# Altium project Crane-control-system.PrjPcb
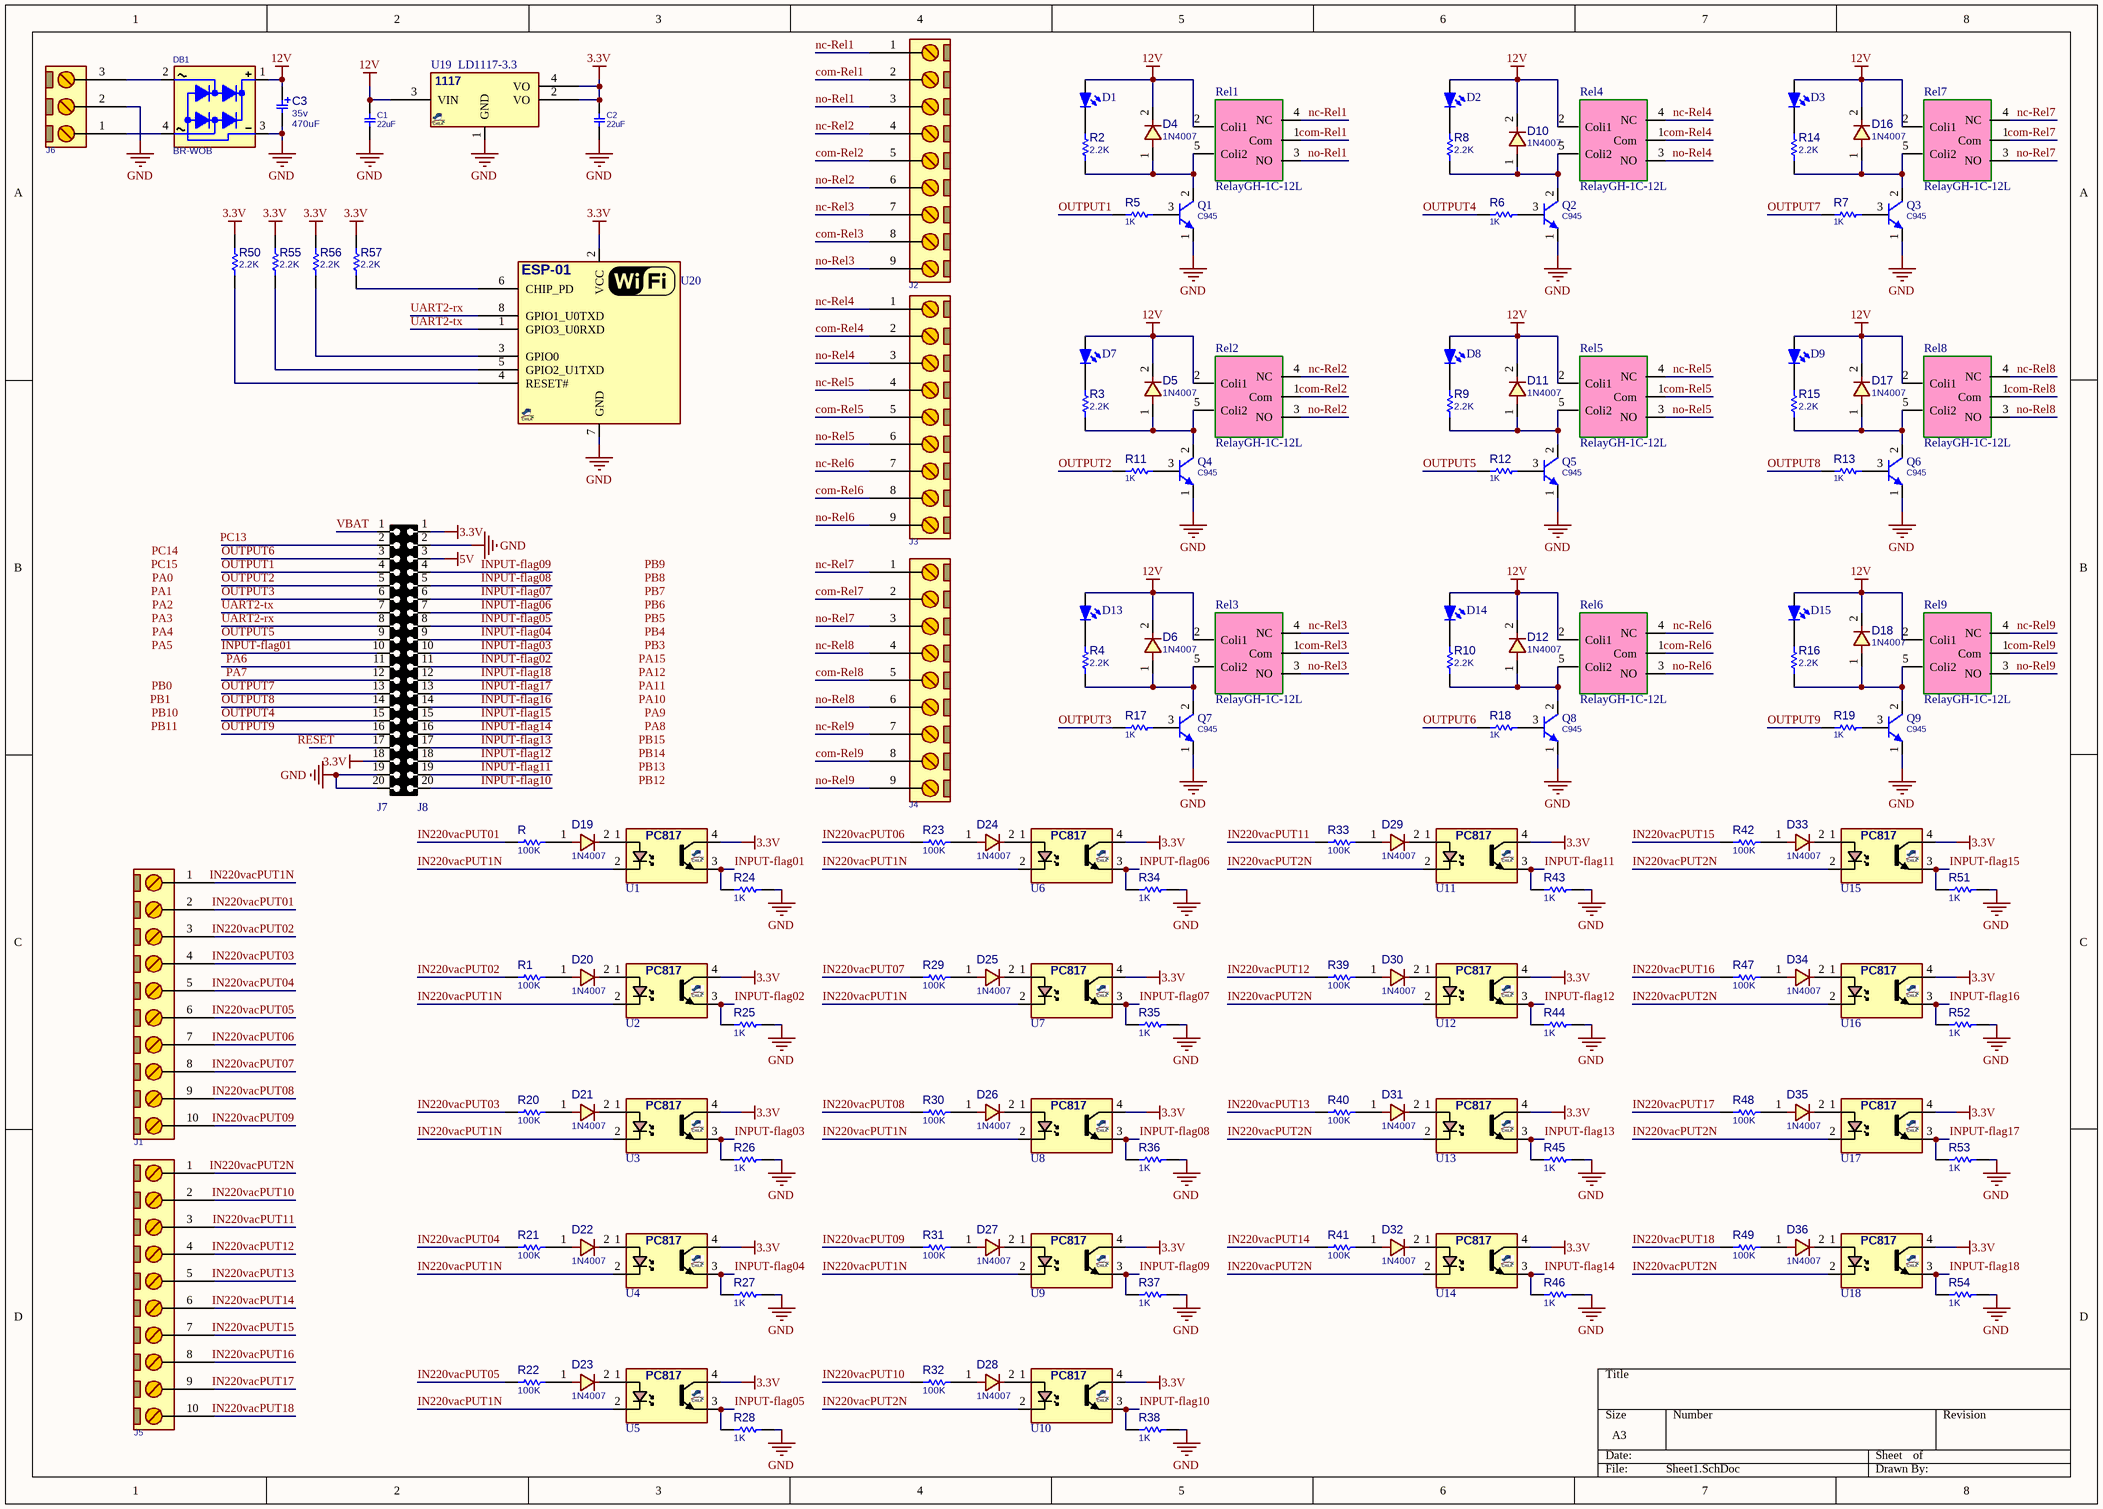
[diagram p0: Sheet1.SchDoc]
1 sheet, 144 parts. Net scope: global (net labels, ports and power ports of the same name join across sheets).
Board file: PCB1.PcbDoc

## Sheet Sheet1.SchDoc
size A3; SheetNumber: 1; SheetTotal: 1

### Parts
C1  22uF  [C0805]
C2  22uF  [C0805]
C3  PARAM2: 35v  [C_EL_10X16]  (hidden comment: 470uF)
D1  (no value)  [0805 LED]
D2  (no value)  [0805 LED]
D3  (no value)  [0805 LED]
D4  1N4007  [D_SMA]
D5  1N4007  [D_SMA]
D6  1N4007  [D_SMA]
D7  (no value)  [0805 LED]
D8  (no value)  [0805 LED]
D9  (no value)  [0805 LED]
D10  1N4007  [D_SMA]
D11  1N4007  [D_SMA]
D12  1N4007  [D_SMA]
D13  (no value)  [0805 LED]
D14  (no value)  [0805 LED]
D15  (no value)  [0805 LED]
D16  1N4007  [D_SMA]
D17  1N4007  [D_SMA]
D18  1N4007  [D_SMA]
D19  1N4007  [D_SMA]
D20  1N4007  [D_SMA]
D21  1N4007  [D_SMA]
D22  1N4007  [D_SMA]
D23  1N4007  [D_SMA]
D24  1N4007  [D_SMA]
D25  1N4007  [D_SMA]
D26  1N4007  [D_SMA]
D27  1N4007  [D_SMA]
D28  1N4007  [D_SMA]
D29  1N4007  [D_SMA]
D30  1N4007  [D_SMA]
D31  1N4007  [D_SMA]
D32  1N4007  [D_SMA]
D33  1N4007  [D_SMA]
D34  1N4007  [D_SMA]
D35  1N4007  [D_SMA]
D36  1N4007  [D_SMA]
DB1  BR-WOB  [DBRG_C10]
J1  CONN_TB10  [MSTB_10]  (value not drawn)
J2  CONN_TB9  [MSTB_9]  (value not drawn)
J3  CONN_TB9  [MSTB_9]  (value not drawn)
J4  CONN_TB9  [MSTB_9]  (value not drawn)
J5  CONN_TB10  [MSTB_10]  (value not drawn)
J6  CONN_TB3  [MSTB_3]  (value not drawn)
J7  HDRF20  [HDR_F_1X20]  (value not drawn)
J8  HDRF20  [HDR_F_1X20]  (value not drawn)
Q1  C945  [TO92_3]
Q2  C945  [TO92_3]
Q3  C945  [TO92_3]
Q4  C945  [TO92_3]
Q5  C945  [TO92_3]
Q6  C945  [TO92_3]
Q7  C945  [TO92_3]
Q8  C945  [TO92_3]
Q9  C945  [TO92_3]
R  100K  [R0805]
R1  100K  [R0805]
R2  2.2K  [R0805]
R3  2.2K  [R0805]
R4  2.2K  [R0805]
R5  1K  [R025W_AX04]
R6  1K  [R025W_AX04]
R7  1K  [R025W_AX04]
R8  2.2K  [R0805]
R9  2.2K  [R0805]
R10  2.2K  [R0805]
R11  1K  [R025W_AX04]
R12  1K  [R025W_AX04]
R13  1K  [R025W_AX04]
R14  2.2K  [R0805]
R15  2.2K  [R0805]
R16  2.2K  [R0805]
R17  1K  [R025W_AX04]
R18  1K  [R025W_AX04]
R19  1K  [R025W_AX04]
R20  100K  [R0805]
R21  100K  [R0805]
R22  100K  [R0805]
R23  100K  [R0805]
R24  1K  [R0805]
R25  1K  [R0805]
R26  1K  [R0805]
R27  1K  [R0805]
R28  1K  [R0805]
R29  100K  [R0805]
R30  100K  [R0805]
R31  100K  [R0805]
R32  100K  [R0805]
R33  100K  [R0805]
R34  1K  [R0805]
R35  1K  [R0805]
R36  1K  [R0805]
R37  1K  [R0805]
R38  1K  [R0805]
R39  100K  [R0805]
R40  100K  [R0805]
R41  100K  [R0805]
R42  100K  [R0805]
R43  1K  [R0805]
R44  1K  [R0805]
R45  1K  [R0805]
R46  1K  [R0805]
R47  100K  [R0805]
R48  100K  [R0805]
R49  100K  [R0805]
R50  2.2K  [R0805]
R51  1K  [R0805]
R52  1K  [R0805]
R53  1K  [R0805]
R54  1K  [R0805]
R55  2.2K  [R0805]
R56  2.2K  [R0805]
R57  2.2K  [R0805]
Rel1  RelayGH-1C-12L  [GH-1C-12L]
Rel2  RelayGH-1C-12L  [GH-1C-12L]
Rel3  RelayGH-1C-12L  [GH-1C-12L]
Rel4  RelayGH-1C-12L  [GH-1C-12L]
Rel5  RelayGH-1C-12L  [GH-1C-12L]
Rel6  RelayGH-1C-12L  [GH-1C-12L]
Rel7  RelayGH-1C-12L  [GH-1C-12L]
Rel8  RelayGH-1C-12L  [GH-1C-12L]
Rel9  RelayGH-1C-12L  [GH-1C-12L]
U1  PC817  [DIP_4]  (value not drawn)
U2  PC817  [DIP_4]  (value not drawn)
U3  PC817  [DIP_4]  (value not drawn)
U4  PC817  [DIP_4]  (value not drawn)
U5  PC817  [DIP_4]  (value not drawn)
U6  PC817  [DIP_4]  (value not drawn)
U7  PC817  [DIP_4]  (value not drawn)
U8  PC817  [DIP_4]  (value not drawn)
U9  PC817  [DIP_4]  (value not drawn)
U10  PC817  [DIP_4]  (value not drawn)
U11  PC817  [DIP_4]  (value not drawn)
U12  PC817  [DIP_4]  (value not drawn)
U13  PC817  [DIP_4]  (value not drawn)
U14  PC817  [DIP_4]  (value not drawn)
U15  PC817  [DIP_4]  (value not drawn)
U16  PC817  [DIP_4]  (value not drawn)
U17  PC817  [DIP_4]  (value not drawn)
U18  PC817  [DIP_4]  (value not drawn)
U19  LD1117-3.3  [SOT223_4]
U20  ESP-01  [ESP8266_ESP01]  (value not drawn)

### Nets
3.3V: C2.2 J7.18 J8.1 R50.1 R55.1 R56.1 R57.1 U1.4(C) U2.4(C) U3.4(C) U4.4(C) U5.4(C) U6.4(C) U7.4(C) U8.4(C) U9.4(C) U10.4(C) U11.4(C) U12.4(C) U13.4(C) U14.4(C) U15.4(C) U16.4(C) U17.4(C) U18.4(C) U19.2(VO) U19.4(VO) U20.2(VCC)
5V: J8.3
12V: C1.2 C3.1 D1.1(A) D2.1(A) D3.1(A) D4.2 D5.2 D6.2 D7.1(A) D8.1(A) D9.1(A) D10.2 D11.2 D12.2 D13.1(A) D14.1(A) D15.1(A) D16.2 D17.2 D18.2 DB1.1(+DC) Rel1.2(Coli1) Rel2.2(Coli1) Rel3.2(Coli1) Rel4.2(Coli1) Rel5.2(Coli1) Rel6.2(Coli1) Rel7.2(Coli1) Rel8.2(Coli1) Rel9.2(Coli1) U19.3(VIN)
GND: C1.1 C2.1 C3.2 DB1.3(-DC) J6.2 J7.19 J7.20 J8.2 Q1.1(E) Q2.1(E) Q3.1(E) Q4.1(E) Q5.1(E) Q6.1(E) Q7.1(E) Q8.1(E) Q9.1(E) R24.1 R25.1 R26.1 R27.1 R28.1 R34.1 R35.1 R36.1 R37.1 R38.1 R43.1 R44.1 R45.1 R46.1 R51.1 R52.1 R53.1 R54.1 U19.1(GND) U20.7(GND)
com-Rel1: J2.2 Rel1.1(Com)
com-Rel2: J2.5 Rel2.1(Com)
com-Rel3: J2.8 Rel3.1(Com)
com-Rel4: J3.2 Rel4.1(Com)
com-Rel5: J3.5 Rel5.1(Com)
com-Rel6: J3.8 Rel6.1(Com)
com-Rel7: J4.2 Rel7.1(Com)
com-Rel8: J4.5 Rel8.1(Com)
com-Rel9: J4.8 Rel9.1(Com)
IN220vacPUT01: J1.2 R.1
IN220vacPUT1N: J1.1 U1.2(K) U2.2(K) U3.2(K) U4.2(K) U5.2(K) U6.2(K) U7.2(K) U8.2(K) U9.2(K)
IN220vacPUT02: J1.3 R1.1
IN220vacPUT2N: J5.1 U10.2(K) U11.2(K) U12.2(K) U13.2(K) U14.2(K) U15.2(K) U16.2(K) U17.2(K) U18.2(K)
IN220vacPUT03: J1.4 R20.1
IN220vacPUT04: J1.5 R21.1
IN220vacPUT05: J1.6 R22.1
IN220vacPUT06: J1.7 R23.1
IN220vacPUT07: J1.8 R29.1
IN220vacPUT08: J1.9 R30.1
IN220vacPUT09: J1.10 R31.1
IN220vacPUT10: J5.2 R32.1
IN220vacPUT11: J5.3 R33.1
IN220vacPUT12: J5.4 R39.1
IN220vacPUT13: J5.5 R40.1
IN220vacPUT14: J5.6 R41.1
IN220vacPUT15: J5.7 R42.1
IN220vacPUT16: J5.8 R47.1
IN220vacPUT17: J5.9 R48.1
IN220vacPUT18: J5.10 R49.1
INPUT-flag01: J7.10 R24.2 U1.3(E)
INPUT-flag02: J8.11 R25.2 U2.3(E)
INPUT-flag03: J8.10 R26.2 U3.3(E)
INPUT-flag04: J8.9 R27.2 U4.3(E)
INPUT-flag05: J8.8 R28.2 U5.3(E)
INPUT-flag06: J8.7 R34.2 U6.3(E)
INPUT-flag07: J8.6 R35.2 U7.3(E)
INPUT-flag08: J8.5 R36.2 U8.3(E)
INPUT-flag09: J8.4 R37.2 U9.3(E)
INPUT-flag10: J8.20 R38.2 U10.3(E)
INPUT-flag11: J8.19 R43.2 U11.3(E)
INPUT-flag12: J8.18 R44.2 U12.3(E)
INPUT-flag13: J8.17 R45.2 U13.3(E)
INPUT-flag14: J8.16 R46.2 U14.3(E)
INPUT-flag15: J8.15 R51.2 U15.3(E)
INPUT-flag16: J8.14 R52.2 U16.3(E)
INPUT-flag17: J8.13 R53.2 U17.3(E)
INPUT-flag18: J8.12 R54.2 U18.3(E)
nc-Rel1: J2.1 Rel1.4(NC)
nc-Rel2: J2.4 Rel2.4(NC)
nc-Rel3: J2.7 Rel3.4(NC)
nc-Rel4: J3.1 Rel4.4(NC)
nc-Rel5: J3.4 Rel5.4(NC)
nc-Rel6: J3.7 Rel6.4(NC)
nc-Rel7: J4.1 Rel7.4(NC)
nc-Rel8: J4.4 Rel8.4(NC)
nc-Rel9: J4.7 Rel9.4(NC)
no-Rel1: J2.3 Rel1.3(NO)
no-Rel2: J2.6 Rel2.3(NO)
no-Rel3: J2.9 Rel3.3(NO)
no-Rel4: J3.3 Rel4.3(NO)
no-Rel5: J3.6 Rel5.3(NO)
no-Rel6: J3.9 Rel6.3(NO)
no-Rel7: J4.3 Rel7.3(NO)
no-Rel8: J4.6 Rel8.3(NO)
no-Rel9: J4.9 Rel9.3(NO)
OUTPUT1: J7.4 R5.1
OUTPUT2: J7.5 R11.1
OUTPUT3: J7.6 R17.1
OUTPUT4: J7.15 R6.1
OUTPUT5: J7.9 R12.1
OUTPUT6: J7.3 R18.1
OUTPUT7: J7.13 R7.1
OUTPUT8: J7.14 R13.1
OUTPUT9: J7.16 R19.1
PA6: J7.11
PA7: J7.12
PC13: J7.2
RESET: J7.17
UART2-rx: J7.8 U20.8(GPIO1_U0TXD)
UART2-tx: J7.7 U20.1(GPIO3_U0RXD)
VBAT: J7.1
NetD1_2: D1.2(K) R2.2
NetD2_2: D2.2(K) R8.2
NetD3_2: D3.2(K) R14.2
NetD4_1: D4.1 Q1.2(C) R2.1 Rel1.5(Coli2)
NetD5_1: D5.1 Q4.2(C) R3.1 Rel2.5(Coli2)
NetD6_1: D6.1 Q7.2(C) R4.1 Rel3.5(Coli2)
NetD7_2: D7.2(K) R3.2
NetD8_2: D8.2(K) R9.2
NetD9_2: D9.2(K) R15.2
NetD10_1: D10.1 Q2.2(C) R8.1 Rel4.5(Coli2)
NetD11_1: D11.1 Q5.2(C) R9.1 Rel5.5(Coli2)
NetD12_1: D12.1 Q8.2(C) R10.1 Rel6.5(Coli2)
NetD13_2: D13.2(K) R4.2
NetD14_2: D14.2(K) R10.2
NetD15_2: D15.2(K) R16.2
NetD16_1: D16.1 Q3.2(C) R14.1 Rel7.5(Coli2)
NetD17_1: D17.1 Q6.2(C) R15.1 Rel8.5(Coli2)
NetD18_1: D18.1 Q9.2(C) R16.1 Rel9.5(Coli2)
NetD19_1: D19.1 R.2
NetD19_2: D19.2 U1.1(A)
NetD20_1: D20.1 R1.2
NetD20_2: D20.2 U2.1(A)
NetD21_1: D21.1 R20.2
NetD21_2: D21.2 U3.1(A)
NetD22_1: D22.1 R21.2
NetD22_2: D22.2 U4.1(A)
NetD23_1: D23.1 R22.2
NetD23_2: D23.2 U5.1(A)
NetD24_1: D24.1 R23.2
NetD24_2: D24.2 U6.1(A)
NetD25_1: D25.1 R29.2
NetD25_2: D25.2 U7.1(A)
NetD26_1: D26.1 R30.2
NetD26_2: D26.2 U8.1(A)
NetD27_1: D27.1 R31.2
NetD27_2: D27.2 U9.1(A)
NetD28_1: D28.1 R32.2
NetD28_2: D28.2 U10.1(A)
NetD29_1: D29.1 R33.2
NetD29_2: D29.2 U11.1(A)
NetD30_1: D30.1 R39.2
NetD30_2: D30.2 U12.1(A)
NetD31_1: D31.1 R40.2
NetD31_2: D31.2 U13.1(A)
NetD32_1: D32.1 R41.2
NetD32_2: D32.2 U14.1(A)
NetD33_1: D33.1 R42.2
NetD33_2: D33.2 U15.1(A)
NetD34_1: D34.1 R47.2
NetD34_2: D34.2 U16.1(A)
NetD35_1: D35.1 R48.2
NetD35_2: D35.2 U17.1(A)
NetD36_1: D36.1 R49.2
NetD36_2: D36.2 U18.1(A)
NetDB1_2: DB1.2(AC1) J6.3
NetDB1_4: DB1.4(AC2) J6.1
NetQ1_3: Q1.3(B) R5.2
NetQ2_3: Q2.3(B) R6.2
NetQ3_3: Q3.3(B) R7.2
NetQ4_3: Q4.3(B) R11.2
NetQ5_3: Q5.3(B) R12.2
NetQ6_3: Q6.3(B) R13.2
NetQ7_3: Q7.3(B) R17.2
NetQ8_3: Q8.3(B) R18.2
NetQ9_3: Q9.3(B) R19.2
NetR50_2: R50.2 U20.4(RESET#)
NetR55_2: R55.2 U20.5(GPIO2_U1TXD)
NetR56_2: R56.2 U20.3(GPIO0)
NetR57_2: R57.2 U20.6(CHIP_PD)

### Notes on the sheet
- Labels drawn without touching a wire or pin: PA0, PA1, PA2, PA3, PA4, PA5, PA8, PA9, PA10, PA11, PA12, PA15, PB0, PB1, PB3, PB4, PB5, PB6, PB7, PB8, PB9, PB10, PB11, PB12, PB13, PB14, PB15, PC14, PC15
- (in symbol VREG_1117_SOT223) 1117

### Library data of the parts
C1 C2 = CAP_SMD_MLCC_10u25V: CAP, MLCC, X5R 10uF 10% 25V 0805; PARAM: X5R, 10%; MANF_P#: TMK212BBJ106MG; MANF: Taiyo Yuden; PARAM2: 25V; PRICE: 100=6$; VALUE: 22uF
C3 = CAP_THD_EL_470uF_35v: CAP, THD, ELEC,; MANF_P#: MANF_PART#; DESC: DESCRIPTION; DIST#: MOUSER; PARAM: 20%; PRICE: 10= -$; MANF: MANF; ASSEMBLY: ASSEMBLY; VALUE: 470uF
D1-D3 D7-D9 D13-D15 = LED: Published: 8-Jun-2000; LatestRevisionDate: 08-Jul-2005; LatestRevisionNote: Mech Layer 1 removed.; PackageReference: LED-0; Publisher: Altium Limited
D4-D6 D10-D12 D16-D36 = DIODE_SMD_1N4007: DIODE, GENERAL PURPOSE, 1000V/1A; MANF: Kingtronics; DESC: DESCRIPTION; PARAM: 1000V VRRM; PARAM2: 1A; MANF_P#: M7; ASSEMBLY: ASSEMBLY; PRICE: PRICE; VALUE: 1N4007
DB1 = DIODE_THD_BRIDGE_WO: DIODE, BRIDGE,; VALUE: BR-WOB
J1 J5 = CONN_MSTB_10: CONN, PHOENIX MSTB, 5-G, 5.08mm pitch; PARAM2: 320V; PARAM: 12A; VALUE: CONN_TB10
J2-J4 = CONN_MSTB_9: CONN, PHOENIX MSTB, 5-G, 5.08mm pitch; PARAM2: 320V; PARAM: 12A; VALUE: CONN_TB9
J6 = CONN_MSTB_3: CONN, PHOENIX MSTB, 5-G, 5.08mm pitch; PARAM2: 320V; PARAM: 12A; VALUE: CONN_TB3
J7 J8 = HDR_F_1X20: CONN, HEADER, Female, pitch: 2.54mm, 20POS; VALUE: HDRF20
Q1-Q9 = NPN_C945_TO92: BJT, NPN, 50v, 0.15A, THD, TO92, BC945; PARAM2: 250mW; MANF_P#: C945, 2SC945, BC945; PARAM: 50v, 0.15A; MANF: -; VALUE: C945
R = RES_SMD_0805: RESISTOR, SMD; PARAM: -W; DESC: DESCRIPTION; DIST#: MOUSER; PARAM2: 1%; MANF_P#: -; MANF: -; ASSEMBLY: ASSEMBLY; PRICE: 100= 0.5$; VALUE: 100K
R1-R4 R8-R10 R14-R16 R20-R57 = RES_SMD: RESISTOR, SMD; PARAM: -W; DESC: DESCRIPTION; DIST#: MOUSER; PARAM2: 1%; MANF_P#: -; MANF: -; ASSEMBLY: ASSEMBLY; PRICE: 100= 0.5$
  R1 R20-R23 R29-R33 R39-R42 R47-R49: VALUE: 100K
  R2-R4 R8-R10 R14-R16 R50 R55-R57: VALUE: 2.2K
  R24-R28 R34-R38 R43-R46 R51-R54: VALUE: 1K
R5-R7 R11-R13 R17-R19 = RES_THD: RESISTOR, THD; MANF_P#: RK73H1ETTP4701F; MANF: KOA SPEER; PARAM: 0.063W; DESC: DESCRIPTION; DIST#: MOUSER; PARAM2: 1%; ASSEMBLY: ASSEMBLY; PRICE: 100= 0.5$; VALUE: 1K
Rel1-Rel9 = RelayGH-1C-12L: HJR-3FF-12VDC-S-Z
U1-U18 = OPTC_TR4P_PC817: OPTOCOUPLER, TRANSISTOR, 4PIN; PARAM: IF=20mA; PARAM2: VCE = 35V; MANF: SHARP; MANF_P#: PC817; PRICE: -; VALUE: PC817
U19 = VREG_1117_SOT223: REG, Linear, LDO1V, 0.8A, SOT-223; MANF_P#: LD1117, LM1117, AMS1117, TLV1117, REG1117, NCP1117, LT1117, SPX1117; MANF: TI, ON, ST; PARAM2: 1.2/1.5/1.8/2.5/2.85/3.3/5V; PARAM: LDO1V, 0.8A; VALUE: LD1117-3.3
U20 = ESP8266_ESP-01: ESP8266 ESP-01 WiFi Module; MANF_P#: ESP-01; VALUE: ESP-01